# Altium schematic sheet 6 pin connector.SchDoc
size A4
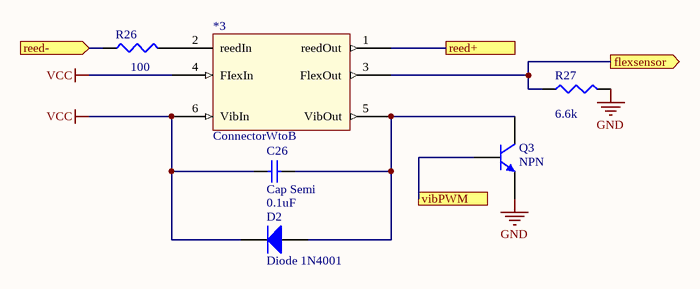
[diagram p0: 6 pin connector.SchDoc]

## Parts
*3  ConnectorWtoB  [Connector_wire_to_PCB]
C26  Cap Semi  value 0.1uF  [C1206]
D2  Diode 1N4001  [DO-41]
Q3  NPN  [TO-226-AA]
R26  value 100  [J1-0603]
R27  value 6.6k  [J1-0603]  (hidden comment: Res3)

## Ports
flexsensor (out), reed+, reed- (in), vibPWM

## Nets
GND: Q3.3(E) R27.2
VCC: *3.4(FIexIn) *3.6(VibIn) C26.1 D2.2(K)
flexsensor: *3.3(FlexOut) R27.1 ; port flexsensor
reed+: *3.1(reedOut) ; port reed+
reed-: R26.1 ; port reed-
vibPWM: Q3.2(B) ; port vibPWM
Net*3_2: *3.2(reedIn) R26.2
Net*3_5: *3.5(VibOut) C26.2 D2.1(A) Q3.1(C)

## Library data of the parts
C26 = Cap Semi: Capacitor (Semiconductor SIM Model); Published: 8-Jun-2000; LatestRevisionDate: 29-May-2009; LatestRevisionNote: IPC-7351 Footprint Added.; PackageReference: C1206; Publisher: Altium Limited; PackageDescription: Chip Capacitor
D2 = Diode 1N4001: 1 Amp General Purpose Rectifier; Published: 8-Jun-2000; LatestRevisionDate: 17-Jul-2002; LatestRevisionNote: Re-released for DXP Platform.; DatasheetVersion: 1998; PackageVersion: Aug-1999; PackageReference: DO-41; Publisher: Altium Limited; PackageDescription: Diode, Axial; Body 5.2 x 2.7 mm (LxDia. max), Lead Dia. 0.86 mm (max); Code_JEDEC: DO-204-AL; ComponentLink1Description: Manufacturer Link; ComponentLink1URL: http://www.fairchildsemi.com/; ComponentLink2Description: Datasheet; ComponentLink2URL: http://www.fairchildsemi.com/ds/1N%2F1N4001.pdf
Q3 = NPN: NPN Bipolar Transistor; Published: 8-Jun-2000; LatestRevisionDate: 17-Jul-2002; LatestRevisionNote: Re-released for DXP Platform.; PackageReference: TO-226-AA; Publisher: Altium Limited; PackageDescription: TO, Flat Index; 3 In-Line, Axial Leads; Body Dia. 4.8mm; Leads 0.55 x 0.51 mm (max); Code_JEDEC: TO-226-AA
R26 R27 = Res3: Resistor; Published: 8-Jun-2000; LatestRevisionDate: 29-May-2009; LatestRevisionNote: IPC-7351 Footprint Added.; PackageReference: J1-0603; Publisher: Altium Limited; PackageDescription: Chip Resistor